# EAGLE board EEZ CF-DIC r5B5 (EAGLE 7.2.0)
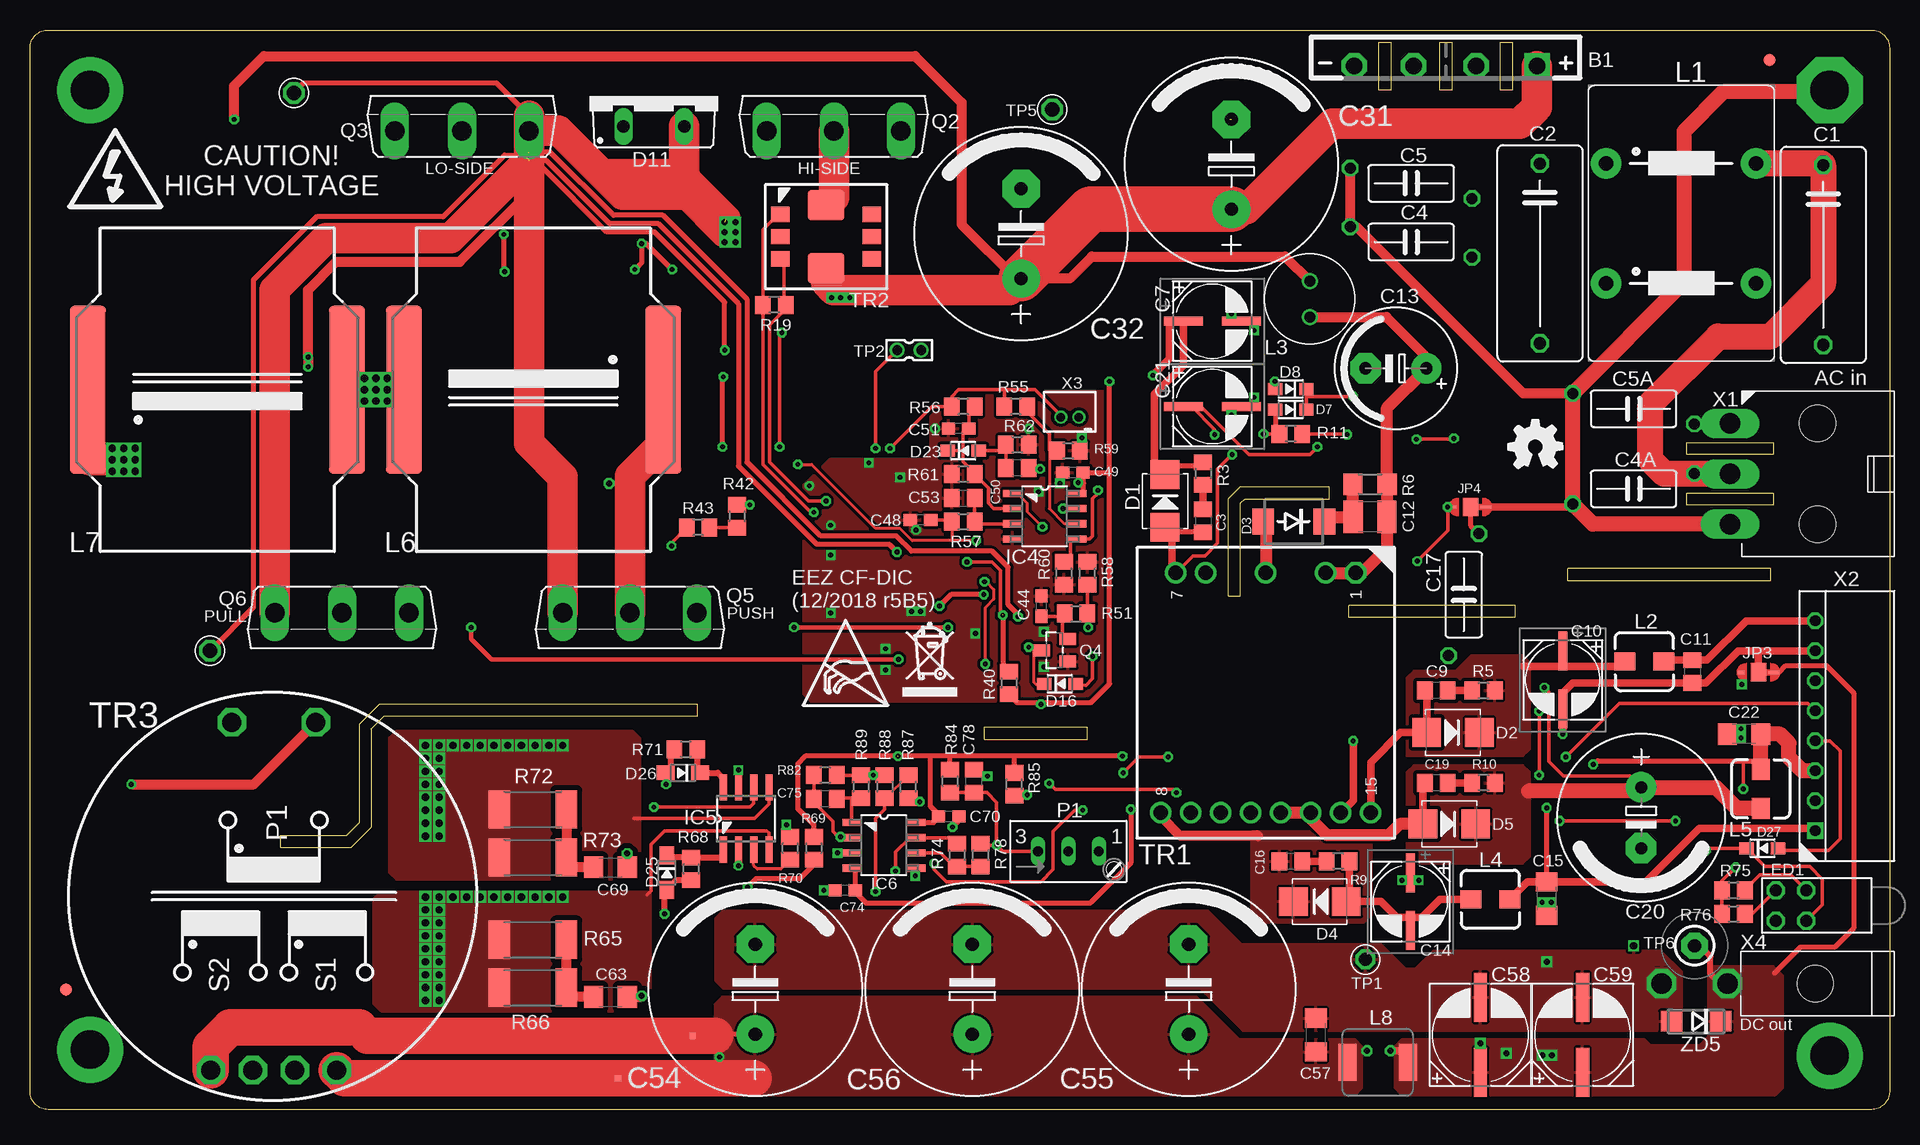
[diagram p3: board, top side]
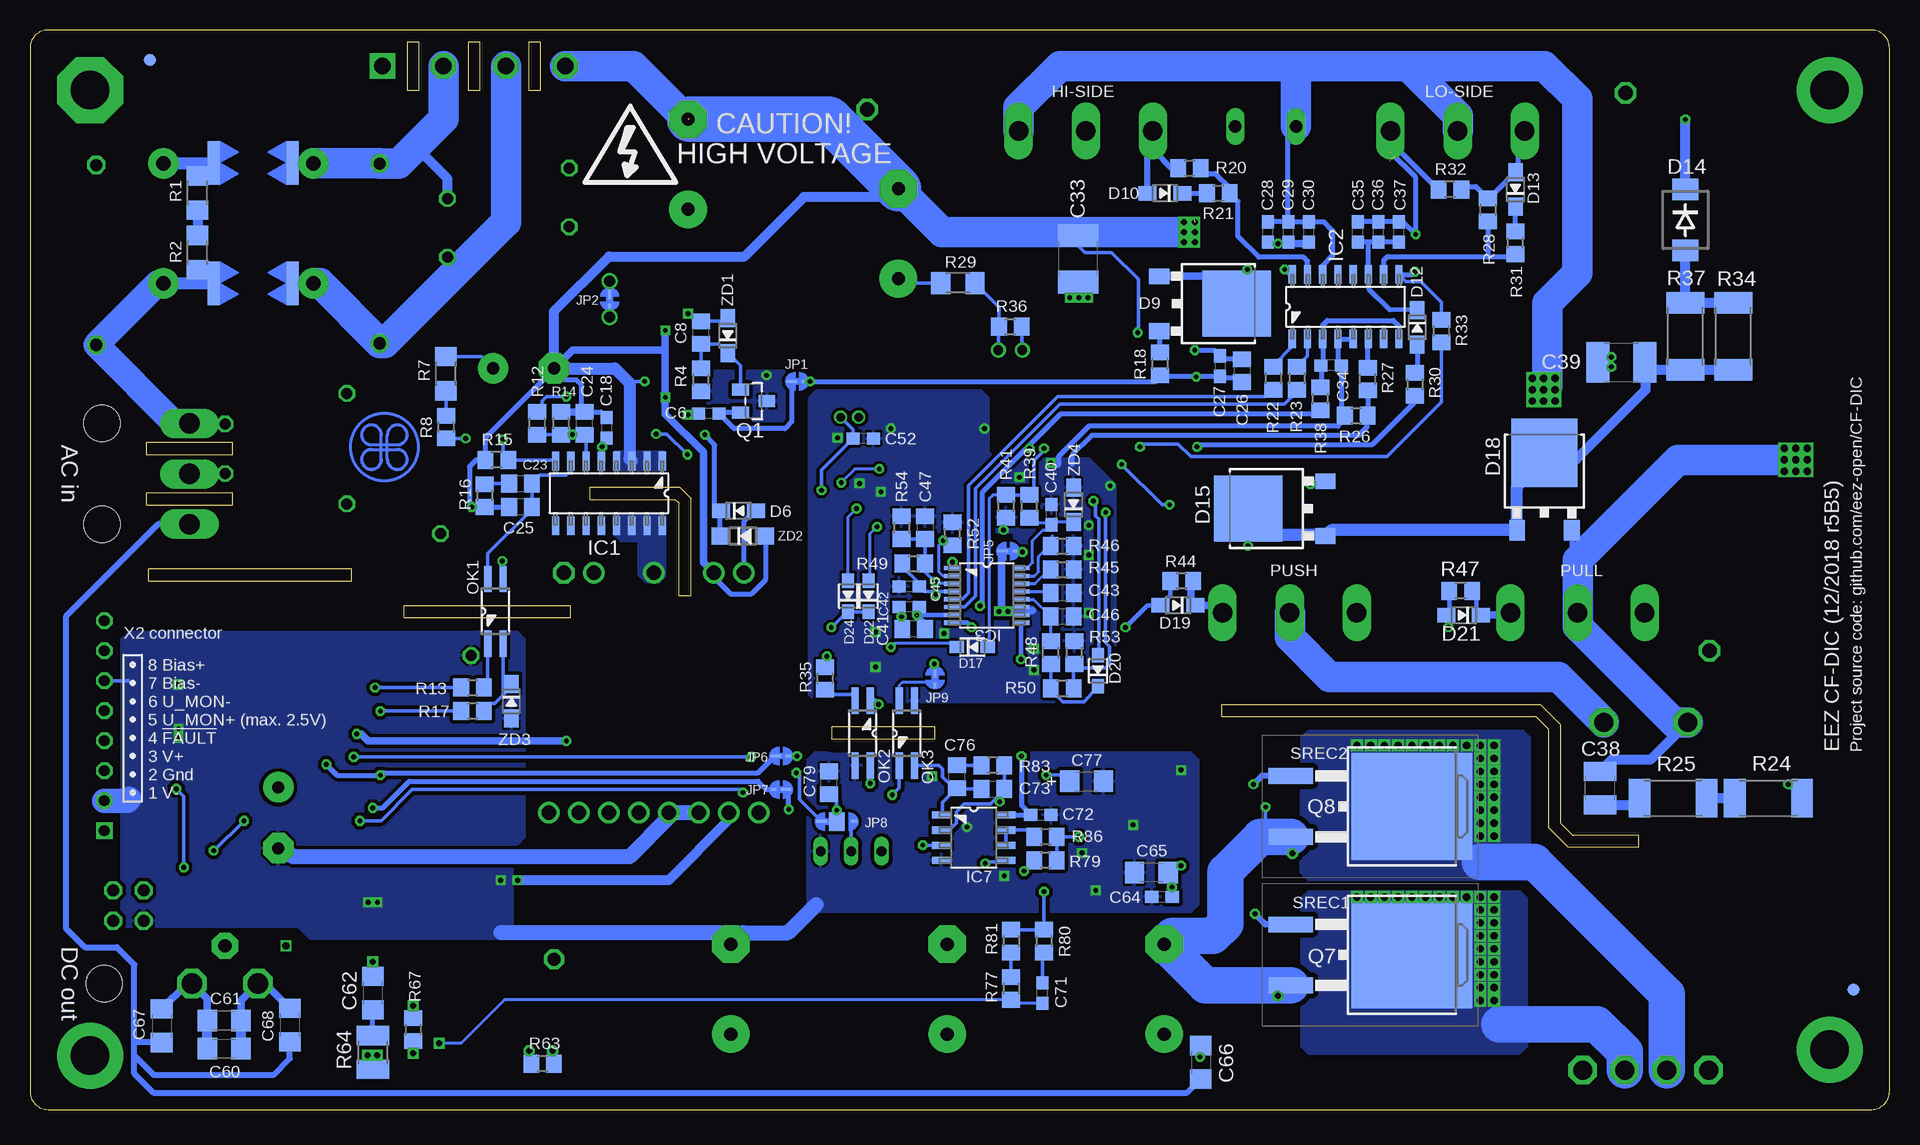
[diagram p4: board, bottom side, seen from below]

Size 155 x 90 mm. Coordinates in mm from the lower left corner, seen from the top.
Outline: 108.3,51.88 100.84,51.88 99.89,50.93 99.89,42.83 100.9,42.83 100.9,50.55 101.22,50.86 108.3,50.86 108.3,51.88
Outline: 145.1,45.09 128.21,45.09 128.21,44.07 145.1,44.07 145.1,45.09
Outline: 123.83,42.04 109.92,42.04 109.92,41.02 123.83,41.02 123.83,42.04
Outline: 79.57,31.88 88.14,31.88 88.14,30.86 79.57,30.86 79.57,31.88
Outline: 155,88.5 155,1.5 arc-90 153.5,0 1.5,0 arc-90 0,1.5 0,88.5 arc-90 1.5,90 153.5,90 arc-90 155,88.5
Outline: 55.63,32.77 55.63,33.78 29.11,33.78 27.43,32.11 27.43,23.9 26.39,22.86 20.89,22.86 20.89,21.84 26.77,21.84 28.45,23.52 28.45,31.73 29.49,32.77 55.63,32.77
Copper layers (1*16): Top 0.035mm / dielectric 1.5mm / Bottom 0.035mm
Design rules "default *": minimum track width 6mil, minimum drill 0.3mm, track to track 6mil, track to pad 6mil, pad to pad 6mil, via to via 6mil, smd to smd 6mil, copper to edge 40mil, drill to drill 8mil, minimum pad ring 4mil, minimum via ring 8mil, stop-mask expansion 2.5mil, vias tented up to drill 2.1mm, thermal gap 8mil
Net classes: 0 default: width 0.203 mm, drill 0.4 mm, clearance 0.203 mm; 2 gnd: width 0.254 mm, drill 0.4 mm, clearance 0.152 mm to class 0, clearance 0.152 mm to class 1, clearance 0.152 mm

## Footprints (pad centres in the part's own frame; a part is rotated, then mirrored left to right if it is on the bottom)
GBU4K_CRE = drill 1.4 square: + -7.62,0 | drill 1.4 octagon: - 7.62,0; AC1 -2.54,0; AC2 2.667,0
C150-072X183 = drill 1.016 octagon: 1 -7.493,0; 2 7.493,0
C0805 = smd 1.3 x 1.5: 1 -0.95,0; 2 0.95,0
CY075-032X103 = drill 0.914 octagon: 1 -5.08,1.27; 2 5.08,-1.27
CY075-032X103-ROTATED = drill 0.914 octagon: 1 -5.08,-1.27; 2 5.08,1.27
C0603 = smd 1.1 x 1: 1 -0.85,0; 2 0.85,0
CAPAE660X610N = smd 3.251 x 0.762: 1 -2.413,0; 2 2.413,0
C1210 = smd 1.6 x 2.7: 1 -1.4,0; 2 1.4,0
ECAP5/10.5 = drill 1.016 pad 2.54: + -2.54,0 | drill 1.016 pad 2.54 octagon: - 2.54,0
C1206 = smd 1.6 x 1.8: 1 -1.4,0; 2 1.4,0
ECAP5/13 = drill 1.016 pad 2.54: + -2.54,0 | drill 1.016 pad 2.54 octagon: - 2.54,0
ECAP7.5/18 = drill 1.1 pad 3.14: + -3.75,0 | drill 1.1 pad 3.14 octagon: - 3.75,0
C1812 = smd 1.9 x 3.4: 1 -1.95,0; 2 1.95,0
CAPAE830X1050N = smd 4.064 x 1.092: + -3.124,0; - 3.124,0
EC1206 = smd 1.6 x 1.8: + -1.4,0; - 1.4,0
SMB = smd 2.4 x 2.4: A 2.2,0; C -2.2,0
DO214AA = smd 1.8 x 2.2: A 2.55,0; C -2.55,0
SOD323-W = smd 1.5 x 1.2: A 1.45,0; C -1.45,0
SOD323-R = smd 1.2 x 1: A 1.3,0; C -1.3,0
TO252 = smd 1.3 x 1.7: 1 -2.285,-5.49; 2 2.285,-5.49 | smd 5.5 x 5.7: 3 0,0.95
TO220-2 = drill 1.016 long: 1 -2.54,-2.54; 2 2.54,-2.54
FIDUCIAL_DUAL = smd 1.016 x 1.016 bottom: B 0,0 | smd 1.016 x 1.016: T 0,0
SOIC-16 = smd 1.549 x 0.61: 1 -2.692,4.445; 2 -2.692,3.175; 3 -2.692,1.905; 4 -2.692,0.635; 5 -2.692,-0.635; 6 -2.692,-1.905; 7 -2.692,-3.175; 8 -2.692,-4.445; 9 2.692,-4.445; 10 2.692,-3.175; 11 2.692,-1.905; 12 2.692,-0.635; 13 2.692,0.635; 14 2.692,1.905; 15 2.692,3.175; 16 2.692,4.445
MTC16 = smd 1.422 x 0.356: 1 -2.845,2.275; 2 -2.845,1.625; 3 -2.845,0.975; 4 -2.845,0.325; 5 -2.845,-0.325; 6 -2.845,-0.975; 7 -2.845,-1.625; 8 -2.845,-2.275; 9 2.845,-2.275; 10 2.845,-1.625; 11 2.845,-0.975; 12 2.845,-0.325; 13 2.845,0.325; 14 2.845,0.975; 15 2.845,1.625; 16 2.845,2.275
SOIC127P600X173-8N = smd 1.55 x 0.6: 1 -2.7,1.9; 2 -2.7,0.63; 3 -2.7,-0.64; 4 -2.7,-1.91; 5 2.7,-1.91; 6 2.7,-0.64; 7 2.7,0.63; 8 2.7,1.9
SO8 = smd 0.6 x 2.2: 1 -1.905,-2.6; 2 -0.635,-2.6; 3 0.635,-2.6; 4 1.905,-2.6; 5 1.905,2.6; 6 0.635,2.6; 7 -0.635,2.6; 8 -1.905,2.6
JP2-NOCUT = smd 0.889 x 0.254: 1 -0.445,0 | smd 0.508 x 0.254: 2 0.635,0
JP3-CUT = smd 1.27 x 1.524: COM 0,0 | smd 0.889 x 0.254: NC -1.27,0 | smd 0.508 x 0.254: NO 1.46,0
RN214 = drill 1.2 pad 2.54: 1 -6.25,-5; 2 6.25,-5; 3 -6.25,5; 4 6.25,5
DE0403 = smd 1.5 x 1.75: 1 0,1.626; 2 0,-1.625
FERSYTER_DSZ6 = drill 0.9: P$1 -1.5,0; P$2 1.5,0
MURATA_6000B = smd 3 x 14: 1 -10.8,0; 2 10.8,0
IHLP-2020BZ-11 = smd 3.048 x 1.524: 1 0,2.515; 2 0,-2.515
L-934EB = drill 1 octagon: BA -1.27,-1.27; BC -1.27,1.27; TA 1.27,-1.27; TC 1.27,1.27
SO4 = smd 0.6 x 2.2: 1 -0.635,-2.7; 2 0.635,-2.7; 3 0.635,2.7; 4 -0.635,2.7
S64W = drill 0.813 long: A 2.54,1.27; E -2.54,1.27; S 0,1.27
SOT23-BEC = smd 1 x 1.4: B -0.95,-1.1; C 0,1.1; E 0.95,-1.1
TO247BV = drill 1.6 long: D 0,-2.921; G -5.588,-2.921; S 5.588,-2.921
SOT23 = smd 1 x 1.4: 1 -0.95,-1.1; 2 0.95,-1.1; 3 0,1.1
TO263 = smd 1.3 x 3.7: 1 -2.54,-7.87; 2 2.54,-7.87 | smd 8.9 x 10.1: 3 0,2.23
R1206 = smd 1.6 x 1.803: 1 -1.422,0; 2 1.422,0
R0805 = smd 1.3 x 1.5: 1 -0.95,0; 2 0.95,0
R2512 = smd 1.8 x 3.2: 1 -2.8,0; 2 2.8,0
R1210 = smd 1.6 x 2.7: 1 -1.4,0; 2 1.4,0
PCB-SAR_2.4MM = smd 3.632 x 1.016: 1 0,-3.302; 2 0,3.302
SHORT_NOHOLE = smd 0.5 x 0.25 bottom: P$1 0,0.117; P$2 0,-0.117
PCB_SHIELD_TAB = drill 1.1 octagon: 1 0,0
2MM-2 = drill 0.8 pad 1.27: 1 0,-1; 2 0,1
TEST-PIN_1.2MM = drill 1.2 octagon: 1 0,0
TP_1.1MM_2 = drill 0.6 square: GND 5.08,0 | drill 1.1 pad 2.184 octagon: TIP 0,0
FERYSTER_5572 = drill 1.2 octagon: 1 -10,7.5 | drill 1.2: 2 -10,5; 4 -10,0; 6 -10,-5; 7 -10,-7.5; 8 10,-8.75; 9 10,-6.25; 10 10,-3.75; 11 10,-1.25; 12 10,1.25; 13 10,3.75; 14 10,6.25; 15 10,8.75
MURATA_5300 = smd 1.27 x 1.524: 1 -1.854,-3.81; 2 0,-3.81; 3 1.854,-3.81; 4 1.854,3.81; 5 0,3.81; 6 -1.854,3.81 | smd 2.54 x 3.048: 7 2.616,0; 8 -2.616,0
VAC_DUAL_SEC = drill 1.6 octagon: P1 -14.5,3.5; P1_DOT -14.5,-3.5; S1 14.5,5.25; S1_DOT 14.5,1.75; S2 14.5,-1.75; S2_DOT 14.5,-5.25
MINIFIT_6659-3_CRE = drill 1.7 long: 1 0,-4.2; 2 0,0; 3 0,4.2 | hole 3: -7.3,4.2; -7.3,-4.2
SPOX_22-05-7085 = drill 0.9 square: 1 -8.75,0 | drill 0.9 octagon: 2 -6.25,0; 3 -3.75,0; 4 -1.25,0; 5 1.25,0; 6 3.75,0; 7 6.25,0; 8 8.75,0
B2B-ZR = drill 0.7 pad 1.1: 1 -0.75,0; 2 0.75,0
MINIFIT_39301020 = drill 1.7 octagon: 1 0,0; 2 0,5.5 | hole 3: 0,-7.3
SOD123 = smd 1.4 x 1.4: A 1.9,0; C -1.9,0
DO214AC = smd 1.8 x 1.7: A 2.05,0; C -2.05,0

## Placement (x,y rotation side)
B1  GBU4K  [GBU4K_CRE]  118,87 180 top
C1  MKP-X2-220NR15/310  [C150-072X183]  149.48,71.25 270 top
C2  MKP-X2-220NR15/310  [C150-072X183]  125.86,71.37 270 top
C3  3n3  [C0805]  97.79,49.09 270 top
C4  CY1Y-4N7  [CY075-032X103]  115.13,72.33 0 top
C4A  N.C.  [CY075-032X103-ROTATED]  133.67,51.75 0 top
C5  CY1Y-4N7  [CY075-032X103]  115.13,77.22 0 top
C5A  N.C.  [CY075-032X103]  133.67,58.42 0 top
C6  N.C.  [C0603]  98.42,58.04 180 bottom
C7  EEEFK1V470P  [CAPAE660X610N]  98.55,65.72 0 top
C8  1u  [C0805]  99.06,64.77 90 bottom
C9  3n3  [C0805]  117.22,34.92 180 top
C10  EEEFK1V470P  [CAPAE660X610N]  127.76,35.81 270 top
C11  1u  [C0805]  138.56,36.51 270 top
C12  1n/1kV  [C1210]  111.7,49.4 180 top
C13  UCY2G6R8MPD  [ECAP5/10.5]  113.86,61.79 180 top
C14  EEEFK1V470P  [CAPAE660X610N]  115.06,17.34 270 top
C15  4u7  [C1206]  126.43,17.59 90 top
C16  3n3  [C0805]  105.09,20.7 180 top
C17  CY1Y-4N7  [CY075-032X103]  119.51,42.93 270 top
C18  100n  [C0603]  106.93,56.83 270 bottom
C19  3n3  [C0805]  117.22,27.24 180 top
C20  1500u  [ECAP5/13]  134.3,24.32 270 top
C21  EEEFK1V470P  [CAPAE660X610N]  98.55,58.61 0 top
C22  4u7  [C1206]  142.88,31.31 180 top
C23  33n  [C0805]  114.11,52.2 0 bottom
C24  100p  [C0805]  108.78,57.21 90 bottom
C25  2n2  [C0805]  114.11,50.23 180 bottom
C26  1u  [C0805]  53.98,61.59 270 bottom
C27  100n  [C0603]  55.82,61.98 270 bottom
C28  10n  [C0603]  51.82,73.15 90 bottom
C29  100n  [C0603]  50.1,73.15 90 bottom
C30  100n  [C0603]  48.39,73.15 90 bottom
C31  UPH2G151MHD6  [ECAP7.5/18]  100.14,78.8 90 top
C32  UPH2G151MHD6  [ECAP7.5/18]  82.61,73.03 90 top
C33  100n/500V  [C1812]  67.63,70.93 90 bottom
C34  100n  [C0603]  46.55,62.04 180 bottom
C35  10n  [C0603]  44.32,73.15 90 bottom
C36  100n  [C0603]  42.61,73.15 90 bottom
C37  100n  [C0603]  40.89,73.15 90 bottom
C38  4n7/200V  [C1210]  24.13,26.8 90 bottom
C39  100n/500V  [C1812]  22.35,62.29 0 bottom
C40  100n  [C0603]  69.85,49.59 90 bottom
C41  1u  [C0805]  81.34,40.07 180 bottom
C42  100n  [C0603]  81.72,41.91 180 bottom
C43  1u  [C0805]  68.96,43.05 180 bottom
C44  10n  [C0603]  84.33,41.97 90 top
C45  100n  [C0603]  81.72,43.62 0 bottom
C46  2n2  [C0805]  68.96,41.08 180 bottom
C47  470p  [C0805]  80.39,48.51 270 bottom
C48  10n  [C0603]  74.23,49.15 180 top
C49  100n  [C0603]  86.93,53.09 180 top
C50  1u  [C0805]  82.3,53.47 180 top
C51  100n  [C0603]  77.41,56.77 180 top
C52  N.C.  [C0603]  85.53,55.94 180 bottom
C53  1u  [C0805]  77.79,50.99 0 top
C54  UPW1J152MHD  [ECAP7.5/18]  60.45,10.03 90 top
C55  UPW1J152MHD  [ECAP7.5/18]  96.58,10.03 90 top
C56  UPW1J152MHD  [ECAP7.5/18]  78.55,10.03 90 top
C57  1u/100V  [C1206]  107.19,6.22 90 top
C58  HHXC630ARA330MHA0G  [CAPAE830X1050N]  120.9,6.22 90 top
C59  N.C.  [CAPAE830X1050N]  129.41,6.22 90 top
C60  1u/100V  [C1206]  138.81,5.08 0 bottom
C61  100n/100V  [C1206]  138.81,7.43 0 bottom
C62  N.C.  [C1206]  126.43,9.72 270 bottom
C63  4n7/200V  [C1206]  48.39,9.4 0 top
C64  100n  [C0603]  60.64,17.72 180 bottom
C65  4u7  [C1206]  61.53,19.75 180 bottom
C66  4n7/200V  [C1206]  57.4,3.94 270 bottom
C67  4n7/200V  [C1206]  144.02,6.99 270 bottom
C68  4n7/200V  [C1206]  133.35,7.05 270 bottom
C69  4n7/200V  [C1206]  48.39,20.19 0 top
C70  100n  [C0603]  76.58,24.45 0 top
C71  10n  [C0603]  70.61,9.72 90 bottom
C72  100n  [C0603]  70.74,24.57 0 bottom
C73  100p  [C0805]  74.74,26.73 0 bottom
C74  100n  [C0603]  67.94,18.29 180 top
C75  100p  [C0805]  66.29,25.91 180 top
C76  2n2  [C0805]  77.72,27.75 90 bottom
C77  4u7  [EC1206]  66.93,27.37 0 bottom
C78  1u  [C0805]  78.68,27.37 90 top
C79  N.C.  [C0805]  88.39,27.24 90 bottom
D1  SS110B  [SMB]  94.61,50.74 270 top
D2  SS110B  [SMB]  118.62,31.43 180 top
D3  US1K-DIO  [DO214AA]  105.35,49.02 180 top
D4  SS110B  [SMB]  107.51,17.34 0 top
D5  SS110B  [SMB]  118.3,23.81 180 top
D6  1N5819HW-7-F  [SOD323-W]  95.95,49.91 0 bottom
D7  BAS316  [SOD323-R]  105.09,58.36 180 top
D8  BAS316  [SOD323-R]  105.09,60.07 180 top
D9  C3D02065E  [TO252]  55.37,67.18 270 bottom
D10  1N5819HW-7-F  [SOD323-W]  60.39,76.39 180 bottom
D11  C3D06065A  [TO220-2]  52,84.5 0 top
D12  1N5819HW-7-F  [SOD323-W]  39.37,65.21 270 bottom
D13  1N5819HW-7-F  [SOD323-W]  31.18,76.71 90 bottom
D14  US1K-DIO  [DO214AA]  17.02,74.17 270 bottom
D15  C3D02065E  [TO252]  52.51,50.1 90 bottom
D16  BAS316  [SOD323-R]  85.85,35.5 0 top
D17  BAS316  [SOD323-R]  76.45,38.54 0 bottom
D18  C3D02065E  [TO252]  28.77,53.78 0 bottom
D19  N.C.  [SOD323-W]  59.31,42.04 180 bottom
D20  BAS316  [SOD323-R]  65.98,36.58 90 bottom
D21  N.C.  [SOD323-W]  35.5,41.21 180 bottom
D22  BAS316  [SOD323-R]  85.09,42.8 90 bottom
D23  BAS316  [SOD323-R]  77.79,54.93 0 top
D24  BAS316  [SOD323-R]  86.8,42.8 90 bottom
D25  1N5819HW-7-F  [SOD323-W]  53.09,19.75 270 top
D26  1N5819HW-7-F  [SOD323-W]  54.42,28.07 180 top
D27  BAS316  [SOD323-R]  144.4,21.78 0 top
EEZ_SIGNATURE  SIGNATURESMALL  [SIGNATURE_5MM]  125.46,55.22 180 top
FM1  FIDUCIAL_2  [FIDUCIAL_DUAL]  145,87.5 270 top
FM2  FIDUCIAL_2  [FIDUCIAL_DUAL]  3,10 270 top
IC1  VIPer35L  [SOIC-16]  106.74,51.37 270 bottom
IC2  SI8233BB-D-IS1  [SOIC-16]  45.34,66.93 90 bottom
IC3  LM5041B  [MTC16]  75.25,42.86 0 bottom
IC4  LM258D  [SOIC127P600X173-8N]  84.58,49.47 0 top
IC5  IR11688STRPBF  [SO8]  59.69,24.26 0 top
IC6  LM258D  [SOIC127P600X173-8N]  71.18,22.03 0 top
IC7  TL103W  [SOIC127P600X173-8N]  76.33,22.67 0 bottom
JP1  JP2-NOCUT  [JP2-NOCUT]  91.06,60.71 0 bottom
JP2  JP2-NOCUT  [JP2-NOCUT]  106.68,67.56 270 bottom
JP3  JP3-CUT  [JP3-CUT]  144.08,36.45 180 top
JP4  JP3-CUT  [JP3-CUT]  120.08,50.23 180 top
JP5  JP2-NOCUT  [JP2-NOCUT]  73.47,46.55 0 bottom
JP6  JP2-NOCUT  [JP2-NOCUT]  92.39,29.46 0 bottom
JP7  JP2-NOCUT  [JP2-NOCUT]  92.39,26.67 180 bottom
JP8  JP3-CUT  [JP3-CUT]  87.76,24 0 bottom
JP9  JP2-NOCUT  [JP2-NOCUT]  79.57,36 270 bottom
L1  RN214-2.5-02-3M3  [RN214]  137.64,73.88 0 top
L2  DLG-0403-180  [DE0403]  134.56,37.34 90 top
L3  RLB0812-471KL  [FERSYTER_DSZ6]  106.68,67.56 270 top
L4  DLG-0403-180  [DE0403]  121.73,17.53 90 top
L5  DLG-0403-180  [DE0403]  144.27,26.73 180 top
L6  60B684C  [MURATA_6000B]  41.97,60.01 180 top
L7  60B684C  [MURATA_6000B]  15.62,60.01 0 top
L8  IHLP2020CZER3R3M11  [IHLP-2020BZ-11]  112.33,3.94 90 top
LED1  L-934EB/1Y1ID-RV  [L-934EB]  146.8,17 180 top
OK1  TLP291-GB.SE-T  [SO4]  116.2,41.53 0 bottom
OK2  TLP291-GB.SE-T  [SO4]  85.6,31.37 180 bottom
OK3  TLP291-GB.SE-T  [SO4]  81.92,31.37 0 bottom
P1  T910W-50K  [S64W]  86.55,20.26 0 top
Q1  MMBT5551  [SOT23-BEC]  94.68,59.05 270 bottom
Q2  C3M0280090D  [TO247BV]  67,84.5 0 top
Q3  C3M0280090D  [TO247BV]  36,84.5 0 top
Q4  NYC0102BLT1G  [SOT23]  85.41,38.29 90 top
Q5  C3M0280090D  [TO247BV]  50,38.5 180 top
Q6  C3M0280090D  [TO247BV]  26,38.5 180 top
Q7  FDD86250-F085  [TO263]  42.04,12.89 270 bottom
Q8  FDD86250-F085  [TO263]  42.04,25.27 270 bottom
R1  220K  [R1206]  141.04,76.4 270 bottom
R2  220K  [R1206]  141.04,71.45 270 bottom
R3  120R  [R0805]  97.79,53.02 270 top
R4  1K8  [R0805]  99.06,60.83 90 bottom
R5  120R  [R0805]  121.16,34.92 180 top
R6  220K  [R1206]  111.7,52.13 180 top
R7  220K  [R1206]  120.33,61.34 270 bottom
R8  100K  [R0805]  120.33,56.9 270 bottom
R9  120R  [R0805]  109.03,20.7 180 top
R10  120R  [R0805]  121.16,27.24 180 top
R11  N.C.  [R0805]  105.09,56.32 180 top
R12  47K  [R0805]  112.71,57.21 90 bottom
R13  750R  [R0805]  118.11,35.18 0 bottom
R14  12K  [R0805]  110.74,57.21 270 bottom
R15  1K8  [R0805]  116.08,54.17 180 bottom
R16  47K  [R0805]  117.09,51.18 270 bottom
R17  1K  [R0805]  118.11,33.21 180 bottom
R18  10R  [R0805]  60.83,62.17 270 bottom
R19  10K  [R0805]  62.04,67.08 180 top
R20  33R  [R0805]  58.36,78.49 0 bottom
R21  10R  [R0805]  55.94,76.39 0 bottom
R22  100R  [R0805]  51.37,60.96 270 bottom
R23  100R  [R0805]  49.4,60.96 270 bottom
R24  22R/2-3W  [R2512]  10.1,25.97 0 bottom
R25  22R/2-3W  [R2512]  18.03,25.97 0 bottom
R26  1R  [R0805]  44.45,57.85 0 bottom
R27  30K  [R0805]  43.5,60.9 90 bottom
R28  33R  [R0805]  33.46,74.99 90 bottom
R29  220K  [R1206]  77.66,68.9 0 bottom
R30  10R  [R0805]  39.56,60.45 270 bottom
R31  10R  [R0805]  31.18,72.26 90 bottom
R32  47K  [R0805]  36.64,76.71 180 bottom
R33  1R  [R0805]  37.34,64.9 90 bottom
R34  22R/2-3W  [R2512]  13.02,64.45 90 bottom
R35  1K  [R0805]  88.71,35.94 90 bottom
R36  100K  [R0805]  73.28,65.28 0 bottom
R37  22R/2-3W  [R2512]  17.02,64.45 90 bottom
R38  10R  [R0805]  47.43,59.25 90 bottom
R39  1K  [R0805]  71.69,50.29 90 bottom
R40  10R  [R0805]  81.6,35.56 270 top
R41  10K  [R0805]  73.66,50.29 270 bottom
R42  30K  [R0805]  58.93,49.47 270 top
R43  100K  [R0805]  55.69,48.51 180 top
R44  33R  [R0805]  58.99,44.07 180 bottom
R45  30K  [R0805]  68.96,45.02 0 bottom
R46  82K  [R0805]  68.96,46.99 0 bottom
R47  33R  [R0805]  35.75,43.24 180 bottom
R48  1K  [R0805]  69.91,38.1 90 bottom
R49  N.C.  [R0805]  81.34,45.53 0 bottom
R50  6R2  [R0805]  68.96,35.12 0 bottom
R51  4K7  [R0805]  87.19,41.34 0 top
R52  750R  [R0805]  78.11,48.01 90 bottom
R53  1K  [R0805]  67.94,38.1 90 bottom
R54  8K2  [R0805]  82.36,48.51 270 bottom
R55  4K7  [R0805]  82.17,58.61 180 top
R56  5K6  [R0805]  77.79,58.61 180 top
R57  47K  [R0805]  77.79,49.02 0 top
R58  1K  [R0805]  88.14,44.7 90 top
R59  30K  [R0805]  86.55,54.93 0 top
R60  10K  [R0805]  86.17,44.7 270 top
R61  1K  [R0805]  77.79,52.96 180 top
R62  1K  [R0805]  82.3,55.44 0 top
R63  120R  [R0805]  112.27,3.81 180 bottom
R64  N.C.  [R1210]  126.43,4.76 270 bottom
R65  22R/2-3W  [R2512]  41.91,14.16 0 top
R66  22R/2-3W  [R2512]  41.91,10.16 0 top
R67  47K  [R0805]  123.06,6.67 270 bottom
R68  3R3  [R0805]  55.12,20.07 90 top
R69  10R  [R0805]  65.34,21.78 270 top
R70  47K  [R0805]  63.37,21.78 90 top
R71  3R3  [R0805]  54.67,30.04 0 top
R72  22R/2-3W  [R2512]  41.91,25.02 0 top
R73  22R/2-3W  [R2512]  41.91,21.02 0 top
R74  10K  [R0805]  77.28,21.21 270 top
R75  470R  [R0805]  141.99,18.29 0 top
R76  470R  [R0805]  141.99,16.32 0 top
R77  100K  [R0805]  73.22,10.1 270 bottom
R78  10K  [R0805]  79.25,21.21 90 top
R79  750R  [R0805]  70.36,20.76 180 bottom
R80  470R  [R0805]  70.48,14.03 270 bottom
R81  51K  [R0805]  73.22,14.03 270 bottom
R82  750R  [R0805]  66.29,27.88 180 top
R83  30K  [R0805]  74.74,28.7 180 bottom
R84  1K8  [R0805]  76.71,27.37 90 top
R85  3K3  [R0805]  82.04,27.11 90 top
R86  750R  [R0805]  70.36,22.73 180 bottom
R87  10K  [R0805]  73.22,26.92 90 top
R88  7K5  [R0805]  71.25,26.92 270 top
R89  220R  [R0805]  69.28,26.92 270 top
SAR1  PCB 2.4mm  [PCB-SAR_2.4MM]  136.4,78.92 270 bottom
SAR2  PCB 2.4mm  [PCB-SAR_2.4MM]  136.4,68.88 270 bottom
SH1  [SHORT_NOHOLE]  100.14,82.55 270 top
SH2  [SHORT_NOHOLE]  49.02,2.6 270 bottom
SH3  [SHORT_NOHOLE]  55.24,6.16 90 bottom
TP1  [PCB_SHIELD_TAB]  111.32,12.51 0 top
TP2  [2MM-2]  73.28,63.31 90 top
TP3  [TEST-PIN_1.2MM]  22,84.75 270 top
TP4  [TEST-PIN_1.2MM]  15,38.25 270 top
TP5  [TEST-PIN_1.2MM]  85.22,83.38 0 top
TP6  [TP_1.1MM_2]  138.75,13.65 180 top
TR1  Feryster 5572  [FERYSTER_5572]  103.01,34.73 270 top
TR2  53100C  [MURATA_5300]  66.36,72.77 270 top
TR3  VAC T60006-L2025-W380  [VAC_DUAL_SEC]  20.32,17.78 270 top
U$2  [RECYCLE_BIN1/8]  72.71,34.42 0 top
U$4  [ESD_SYMBOL]  64.42,33.7 0 top
X1  39-30-3035  [MINIFIT_6659-3_CRE]  141.7,53 180 top
X2  22-05-7085  [SPOX_22-05-7085]  148.8,32 90 top
X3  B2B-ZR  [B2B-ZR]  86.68,57.72 180 top
X4  39-30-1020  [MINIFIT_39301020]  141.5,10.5 90 top
ZD1  BZX384-C13  [SOD323-W]  96.84,64.52 90 bottom
ZD2  BZT52C20-DC  [SOD123]  95.57,47.82 0 bottom
ZD3  MMSZ5V1T1G  [SOD323-W]  114.87,34.04 270 bottom
ZD4  MMSZ5V1T1G  [SOD323-W]  68.01,50.42 90 bottom
ZD5  SMAJ58A-TR  [DO214AC]  138.87,7.37 180 top

## Tracks (layer width: path | path; a pad name or v marks a point on that pad's centre or on a via)
0V  (via drill 0.4, 0.5)  (5 unrouted)
  Top 0.305: D8.A 103.79,60.67 v103.76,60.71 | 42.02,81.6 41.8,81.6 Q3.S | 41.59,79.12 41.59,79.76 41.56,79.79 42.13,79.79 42.16,79.82 | v62.48,55.24 62.48,64.58 v62.67,64.77 | v118.17,50.23 118.17,48.26 v115.63,45.72 | v102.04,64.96 102.04,65.66 101.98,65.72 C7.2 100.14,65.72 v100.14,66.36
  Top 0.406: 42.16,79.82 43.37,79.82 48.64,74.55 52.77,74.55 59.75,67.56 59.75,53.98 65.91,47.82 72.2,47.82 73.47,46.55 80.2,46.55 81.53,45.21 81.53,42.1 82.36,41.27 v82.36,41.08 | 41.59,79.06 40.75,79.06 | 41.59,79.12 43.05,79.12 48.32,73.85 52.39,73.85 59.05,67.18 59.05,53.66 65.6,47.12 71.63,47.12 v72.26,46.48 | 102.04,58.55 101.98,58.61 C21.2 100.08,58.61 100.14,58.55 v100.14,57.91 | v58.8,72.33 v58.8,73.15 v58.8,73.98 v57.91,73.98 v57.91,73.15 v57.91,72.33 | 38.8,75.44 38.26,75.85 | 42.55,77.41 41.59,77.41 | 41.59,78.55 42.67,78.55 48.07,73.15 52.07,73.15 57.91,67.31 v57.91,63.31 | JP4.NO v118.17,50.23 | TP3.1 22,84.8 22.8,85.6 38.86,85.6 41.59,82.87 | 41.21,79.44 41.08,79.57 39.56,79.57 34.42,74.42 23.88,74.42 18.61,69.15 18.61,41.85 TP4.1 | v39.5,72.96 39.5,69.91 v39.56,69.85 | 54.55,77.98 54.55,77.86 54.54,77.85
  Top 0.61: 102.04,58.55 v102.04,59.37 | 41.66,78.3 41.59,78.23
  Top 0.813: 41.37,81.62 Q3.S | 41.59,77.22 41.59,76.45 35.81,70.67 25.53,70.67 23.18,68.33 v23.18,62.74 v23.18,61.91
  Top 2.54: 42.02,81.6 44.07,81.6 49.4,76.26 54.8,76.26 | 41.59,79.06 41.59,79.18 38.26,75.85 35.05,72.64 24.7,72.64 20.41,68.36 Q6.S | 41.59,82.87 41.59,79.12 41.59,78.55 41.59,78.23 41.59,77.41 41.59,77.22 41.59,55.56 44.41,52.74 Q5.S | 54.8,76.26 v57.91,73.15 | D11.2 54.54,77.85 54.54,76.52 54.8,76.26 | 47.75,77.98 54.55,77.98 | 54.86,77.34 57.98,74.23
  Bottom 0.305: v103.76,60.71 104.9,60.71 105.03,60.58 | 114.68,49.85 C25.2 | R16.2 | 37.21,63.95 R33.1 37.34,58.99 41.91,54.42 58.23,54.42 59.31,55.5 62.23,55.5 v62.48,55.24 | R33.2 37.34,67.31 39.05,69.03 40.3,69.03 IC2.9 | 67.56,73.15 67.63,73.09 C33.2 67.63,72.01 67.06,71.44 64.83,71.44 62.61,69.22 62.61,64.83 v62.67,64.77 | OK1.3 115.57,45.66 v115.63,45.72 | 118.36,50.23 v118.17,50.23 | ZD1.A 97.08,65.72 C8.2 99.5,65.72 v100.14,66.36
  Bottom 0.406: R14.1 110.56,58.16 109.03,58.17 109.03,60.39 109.47,60.83 110.36,60.83 C13.- 111.32,61.72 117.03,56.01 R15.2 117.79,54.17 118.36,53.59 118.36,50.23 | R16.2 C25.2 | R16.2 | C24.2 107.42,58.16 C18.1 | ZD2.A 93.66,44.2 94.87,42.99 96.58,42.99 98.01,44.42 TR1.6 | C35.2 C36.2 C37.2 41.11,74.04 40.58,74.04 v39.5,72.96 39.5,77.72 41.59,79.81 41.59,80.71 | IC2.9 39.79,69.62 v39.56,69.85 | C26.1 55.53,62.55 C27.1 56.3,63.31 v57.91,63.31 | R32.2 41.59,80.71 | 41.59,80.71 Q3.S | 58.93,73.15 v58.8,73.15 | R16.2 v118.17,50.23 | C6.2 100.01,58.04 v100.14,57.91 | TP5.1 85.34,83.38 87.28,81.44 | C41.2 82.29,41.02 v82.36,41.08 82.36,41.7 C42.2
  Bottom 0.508: v72.26,46.48 72.83,46.48 JP5.2
  Bottom 0.61: 102.04,63.31 v102.04,59.37 102.04,57.98 98.87,54.8 98.87,45.59 TR1.6 | 102.04,63.31 v102.04,64.96 | R14.1 C24.2 | 102.04,63.31 109.79,63.31 C13.-
  Bottom 0.813: C32.- 83.32,76.07 90.49,76.07 95.44,71.12 106.74,71.12 111.32,66.55 C13.- | C39.1 24.3,62.82 v23.18,62.74
  Bottom 1.016: C13.- 106.24,61.78 105.03,60.58 105.03,54.25 IC1.3
  Bottom 2.54: 58.93,73.15 67.56,73.15 78.99,73.15 C32.-
  Bottom 3.81: SH1.P$2 88.39,82.55 87.28,81.44 C32.-
  pour Bottom (no thermals): 102.11,54.8 106.3,54.8 106.3,53.34 102.11,53.34
6VAC
  Top 0.61: 105.47,24.67 105.41,24.73 | D5.A 116.1,27.13 C19.2
  Top 1.016: TR1.12 105.41,24.73 TR1.13 106.76,24.24 108.14,22.86 113.22,22.86 114.17,23.81 D5.A
7VAC
  Top 0.813: TR1.8 94.26,24.42 95.82,22.86 102.3,22.86 102.36,22.8
  pour Top: 111.76,23.18 111.76,16.19 111.19,15.62 102.43,15.62 101.85,16.19 101.85,23.18
15VAC
  Top 0.61: C9.2 116.42,34.78 D2.A 114.24,31.43 111.76,28.96 TR1.15
!FAULT  (via drill 0.4)
  Top 0.305: v137.16,24.07 v127.51,24.07 | v84.96,27.18 85.47,26.67 95.31,26.67 v95.57,26.42 | v139.7,21.59 139.89,21.78 D27.C 144.62,20.26 148.34,20.26 149.42,19.18 149.42,17.08 149.35,17.02 149.35,17.01 LED1.BC
  Bottom 0.305: v127.51,24.07 125.73,24.07 123.13,26.67 95.82,26.67 v95.57,26.42 | v139.7,21.59 139.64,21.59 v137.16,24.07 | v84.96,27.18 OK2.4
+2.5VREF  (via drill 0.4)
  Top 0.305: R84.1 77.92,26.42 | 77.92,26.42 C78.1 79.75,26.42 80.58,25.59 v80.58,22.04 | 77.98,26.36 77.92,26.42 | R78.2 79.5,22.04 v80.58,22.04 | v80.58,22.04 81.09,21.53 P1.E
  Bottom 0.305: IC7.3 v80.58,22.04
+5VREF  (via drill 0.4)
  Top 0.305: v71.69,55.12 75.18,58.61 R56.2 76.83,59.44 77.41,60.01 81.22,60.01 | R55.2 81.22,60.01 | 81.22,60.01 83.76,60.01 85.93,57.84 X3.2
  Top 0.406: v79.5,42.93 76.77,42.93 v75.82,41.97
  Bottom 0.254: C45.2 80.96,43.62 | R49.1 82.74,45.4
  Bottom 0.305: IC3.4 79.57,43.19 | 79.57,43.19 80.44,43.19 C45.2 80.87,43.85 82.29,45.27 R49.1 | v79.5,42.93 79.57,43.19 | v71.69,55.12 71.69,55.37 71.63,55.44
  Bottom 0.406: R38.1 47.43,57.98 69.09,57.98 71.63,55.44 75.63,51.44 75.63,42.16 v75.82,41.97
+6V_REC  (via drill 0.4)
  Top 0.305: C20.+ 133.35,27.81 127.83,27.81 126.62,29.02 126.62,34.8 v126.24,35.18
  Top 1.27: 124.9,26.54 133.99,26.54 C20.+ 140.53,26.86 142.24,25.15 144.23,25.15 L5.1
  Bottom 0.305: R13.1 v126.24,35.18
  pour Top (isolate 0.305): 124.97,28.13 124.97,21.08 124.4,20.51 114.81,20.51 114.81,28.13 115.38,28.7 124.4,28.7
+12V  (via drill 0.4)
  Top 0.254: v87.38,52.26 87.76,52.26 87.82,52.2
  Top 0.305: C50.1 84.14,53.47 v84.2,53.4
  Top 0.406: v57.72,55.24 57.72,61.02 v57.78,61.09 | R40.2 82.3,33.91 84.26,33.91 | 89.98,53.15 89.98,35.5 88.39,33.91 84.26,33.91 | 89.98,53.15 v89.98,60.71 | 89.98,53.15 89.92,53.09 C49.1 87.82,52.79 87.82,52.2 87.82,51.37 IC4.8 | v84.26,33.78 84.26,33.91
  Bottom 0.254: v84.2,53.4 86.23,53.4 v87.38,52.26
  Bottom 0.406: C26.2 53.98,60.96 55.65,60.96 C27.2 55.85,61.09 v57.78,61.09 60.7,61.09 R18.2 61.15,60.71 v89.98,60.71 JP1.2 | R30.2 39.56,58.99 43.12,55.44 57.53,55.44 v57.72,55.24 | OK2.1 84.55,34.07 v84.26,33.78
+15V_REC
  Top 0.254: 132.33,37.02 132.61,37.02 L2.1
  Top 0.61: C10.1 127.76,36.96 | 127.76,36.96 124.46,36.96 | 127.76,36.96 132.27,36.96 132.33,37.02
  pour Top (isolate 0.305): 124.4,29.46 114.81,29.46 114.81,36 115.38,36.58 118.87,36.58 120.14,37.85 124.4,37.85 124.97,37.27 124.97,30.04
-7V_REC
  Top 0.61: L4.1 117.54,17.53 116.01,16 115.13,16 | 115.13,16 113.92,16 112.58,17.34 D4.A 109.98,17.61 R9.1 | C14.2 115.06,15.94 115.13,16
-15V  (via drill 0.4)
  Top 0.61: v127.76,31.3 C10.2 127.76,34.73 128.59,35.56 C11.2 139.7,35.56 142.39,38.25 144.15,38.25 | v110.3,30.73 110.3,25.77 TR1.14 | X2.7 144.15,38.25 | JP3.COM 144.08,38.19 144.15,38.25
  Bottom 0.61: v110.3,30.73 126.81,30.73 127.38,31.3 v127.76,31.3
AC_L_IN
  Bottom 0.61: X1.1 139.31,57.2 C5A.2
  Bottom 1.016: L1.2 140.91,68.88 | 140.91,68.88 SAR2.1 | R2.2 141.04,69 140.91,68.88
  Bottom 2.184: X1.1 142.93,57.2 C1.2 144.36,68.88 L1.2
AC_N_IN
  Top 0.305: C4A.2 138.75,53
  Top 2.184: X1.2 138.75,53 136.23,53 135.06,54.17 135.06,58.8 140.72,64.45 145.1,64.45 149.48,68.83 C1.1 149.34,78.88 L1.4
  Bottom 1.016: L1.4 141.1,78.88 | 141.1,78.88 139.74,78.88 SAR1.1 | R1.1 141.04,78.81 141.1,78.88
AGND  (via drill 0.4)
  Top 0.305: R59.2 v87.69,56.01
  Bottom 0.254: 43.56,57.47 43.56,57.79 R26.2
  Bottom 0.406: IC2.5 IC2.4 45.97,62.32 C34.1 45.7,58.14 R26.1 45.4,57.53 45.97,56.96 66.74,56.96 69.28,54.42 69.28,53.72 | 67.88,52 ZD4.A | 43.56,57.47 43.56,56.9 44.26,56.2 66.48,56.2 68.14,54.55 68.14,53.78 | R27.1 43.5,57.53 R26.2 | 74.04,41.59 74.17,41.59 v74.23,41.53 | v73.47,41.53 73.47,41.59
  Bottom 0.61: 73.53,41.59 73.47,41.59 71.44,41.59 | 74.04,41.59 74.04,46.42 JP5.1
  other vias: 85.85,52.2 69.91,53.91 73.85,48.32 71.31,38.42 71.31,36.64 72.52,52.7 84.07,51.5 84.52,36.89 66.74,48.7 66.74,46.23 66.74,41.4 78.8,39.69 64.96,52.01 84.52,39.81 83.25,56.77 75.44,56.77
  pour Bottom (isolate 0.254): 74.42,54.23 74.42,48.13 72.96,48.13 72.96,40.64 74.74,40.64 74.74,54.42 75.12,54.8 75.12,59.31 75.69,59.88 89.47,59.88 90.04,59.31 90.04,34.61 89.47,34.04 65.09,34.04 64.52,34.61 64.52,52.07 66.67,54.23
  pour Top (isolate 0.254): 66.67,54.23 74.55,54.23 75.12,54.8 75.12,59.31 75.69,59.88 89.47,59.88 90.04,59.31 90.04,34.04 65.09,34.04 64.52,34.61 64.52,52.07
AUX_AC  (via drill 0.4)
  Top 0.305: R11.2 v102.81,56.33 | TR1.7 96.94,46.16 97.92,46.16 99,47.24 99,53.4 v100.2,54.61
  Top 0.406: D7.A 103.79,56.67 R11.2 | 95.21,48.26 D1.A | C3.2 95.34,48.14 95.21,48.01
  Top 0.61: 95.21,48.26 95.21,48.01 95.21,45.04 TR1.7
  Bottom 0.305: v102.81,56.33 101.92,56.33 v100.2,54.61
  Bottom 0.406: D6.A 94.55,49.91 95.5,48.96 TR1.7
AUX_REC  (via drill 0.4)
  Top 0.406: C7.1 95.06,65.66 95,65.6 | R3.1 97.79,53.78 97.66,53.66 95.34,53.66 D1.C
  Top 0.61: D1.C 94.7,52.87 93.73,53.85 93.73,59.63 96.14,62.04 C7.1 | v93.6,61.21 95,62.61 95,65.6
  pour Bottom (isolate 0.305): 98.68,61.53 98.68,51.5 91.12,51.5 91.12,61.53
BUCK_OUT  (via drill 0.6)
  Top 2.184: L6.2 31.17,64.45 | L7.2 26.42,55.57
  Top 2.54: v28.83,60.01 L7.2 | v29.78,60.01 L6.2
  Bottom 0.305: v29.78,59.05 v29.78,60.01 v29.78,60.96 v28.83,60.96 | v28.83,60.01 v28.83,59.05 | v27.88,59.05 v27.88,60.01 v27.88,60.96 v28.83,60.96 | v28.83,60.96 28.51,60.96 28.51,60.45
  Bottom 0.406: 50.14,74.04 C29.2 C30.2 47.14,74 46.42,73.28 46.42,71.18 47.24,70.36 IC2.14 | 50.14,74.04 50.14,81.51 D11.1 | 50.14,74.04 51.78,74.04 C28.2
  Bottom 0.508: C28.2 51.84,74
  Bottom 2.54: 40.13,87 49.47,87 | 49.47,87 69.15,87 72.59,83.56 Q2.S | v28.83,60.01 28.51,60.33 28.51,60.45 28.51,67.25 26.04,69.72 26.04,84.26 28.77,87 40.13,87 | Q3.D 36,82.86 40.13,87 | D11.1 49.46,86.99 49.47,87
CLAMP_C  (via drill 0.4)
  Top 0.305: v53.47,46.99 53.47,47.24 R43.2
  Bottom 0.305: D15.3 53.47,46.8 v53.47,46.99
  Bottom 0.813: R34.1 R37.1 20.07,61.65 20.32,61.4 | D18.3 26.1,54.23 20.32,60.01 20.32,61.4 | 20.32,61.4 20.32,62.21 C39.2
  Bottom 1.016: D18.3 31.05,51.94 D18.1 46.55,48.29 D15.1 47.12,47.82 47.18,47.88 51.24,47.88 D15.3 53.47,49.91
  Bottom 1.27: 29.02,54.48 D18.3
COMP  (via drill 0.4)
  Top 0.254: v79.63,37.15 79.63,41.85 80.33,42.55 80.33,43.37 79.69,44 v79.57,44
  Bottom 0.254: IC3.3 79.4,43.84 v79.57,44 | v79.63,37.15 79.63,36.51 JP9.1
  Bottom 0.305: R54.2 C47.2 R49.2 80.39,44.83 v79.57,44
CT_OUT+  (via drill 0.4)
  Top 0.305: TR2.3 62.87,70.6 62.87,67.4 R19.1 62.99,66.74 61.66,65.41 61.66,53.98 64.9,50.74 v66.36,50.74
  Bottom 0.305: D20.A 65.98,37.91 65.91,37.97 65.91,49.21 66.17,49.47 66.17,50.55 v66.36,50.74
CT_OUT-  (via drill 0.4)
  Top 0.305: TR2.1 62.85,74.61 62.36,74.61 61.09,73.34 R19.2 | R19.2 61.28,66.74 | R19.2 61.09,53.78 65.09,49.78 v65.34,49.78
  Bottom 0.305: 67.5,37.59 R53.1 | R50.2 68.01,37.08 R53.1 | R53.1 67.56,36.77 67.5,36.83 65.34,36.83 65.02,37.15 65.02,38.61 65.34,38.92 v65.34,49.78
DC_BUS  (via drill 0.4)
  Top 0.305: v67.56,67.69 v66.8,67.69 | 79.34,68.29 79.38,68.33 | 87.88,72.39 87.82,72.39 86.78,73.44
  Top 0.406: v66.8,67.69 66.8,68.14 66.99,68.33 | v68.33,67.69 v67.56,67.69
  Top 0.813: v17.02,82.55 17.02,85.34 19.49,87.82 73.79,87.82 77.66,83.95 77.66,73.79 82.17,69.28 C32.+ 86.67,69.28 88.52,71.12 104.62,71.12 L3.P$1
  Top 2.54: C32.+ 81.67,68.33 79.38,68.33 66.99,68.33 66.36,68.96 TR2.7 | C31.+ 101.41,75.05 108.52,82.17 124.21,82.17 125.62,83.58 B1.+
  Top 3.81: C31.+ 88.39,75.05 86.78,73.44 C32.+
  Bottom 0.305: C33.1 67.63,67.75 v67.56,67.69 | R29.1 82.24,68.9 C32.+
  Bottom 0.61: L3.P$1 JP2.1
  Bottom 0.813: D14.C v17.02,82.55
DC_OUT
  Top 0.61: L2.2 136.31,37.46 C11.1 139.76,37.47 143.05,40.75 X2.8
FB  (via drill 0.4)
  Top 0.254: v78.87,47.43 76.83,47.43 | 76.83,47.43 73.53,47.43 72.52,48.45 70.48,48.45 65.15,53.78 v64.01,53.78 | 77.47,47.44 76.83,47.43 | R57.1 76.84,47.44 76.83,47.43
  Top 0.305: R42.1 v60.01,50.42 | C48.1 76.71,49.15 R57.1
  Bottom 0.254: IC3.2 78.9,44.49 79.25,44.83 79.25,47.05 v78.87,47.43 78.49,47.06 R52.1
  Bottom 0.305: v60.01,50.42 60.64,50.42 v64.01,53.78
FB2
  Bottom 0.305: R17.1 117.16,33.78 117.22,33.85 116.27,33.85 115.57,34.54 | 115.57,34.54 115.25,34.86 | OK1.2 115.57,35.43 | 115.57,35.43 115.57,34.54 | ZD3.C 115.52,35.49 115.57,35.43
GND  (via drill 0.4, 0.5)
  Top 0.254: IC5.7 v59.05,28.3 | v142.69,35.43 142.69,36.39 JP3.NO
  Top 0.305: IC5.6 60.33,25.53 60.01,25.21 v52.01,25.21 | v115.76,19.11 115.06,19.11 | 115.06,19.11 C14.1 | v114.36,19.11 115.06,19.11 | C78.2 78.5,28.3 | v73.78,19.48 73.88,19.58 IC6.5
  Top 0.406: v142.62,30.99 141.79,30.99 C22.2 | v63.05,23.73 63.05,23.05 R70.2 | IC6.3 67.32,21.39 v67.31,21.38 | C74.2 66.18,18.29 v66.16,18.27 | v79.82,27.8 79.82,27.88 79.76,27.94 79.06,27.94 C78.2 | C70.2 77.43,24.08 v76.89,23.54
  Top 0.61: v126.81,17.27 126.81,16.57 C15.1
  Top 0.813: C63.2 50.93,9.4 v50.99,9.46 | C69.2 v49.79,21.33 v49.78,21.34
  Bottom 0.305: v52.01,25.21 52.01,23.11 51.63,22.73 | X2.6 146.81,35.75
  Bottom 0.406: C62.1 v126.43,12.32 | R67.1 v123.06,8.64
  Bottom 0.61: C61.2 137.41,9.09 X4.2 135.4,10.5 C68.1
  Bottom 0.813: v114.36,19.11 101.79,19.11 96.77,24.13 96.77,24.72 TR1.9 | Q7.2 49.91,10.04 v50.99,9.46 | v49.78,21.34 49.28,22.1 Q8.2 | C60.2 C61.2
  Bottom 1.27: C20.- 133.79,21.78 133.1,21.08 105.03,21.08 101.76,24.35 TR1.11 TR1.10 | 115.76,14.73 97.53,14.73 C55.- 96.52,13.78 95.57,14.73 91.82,14.73 89.47,17.08
  Bottom 2.032: X2.2 146.91,25.75 146.75,25.91
  Bottom 3.048: Q8.2 51.63,22.73 52.45,22.73 55.37,19.81 55.37,15.49 56.39,14.48 59.76,14.48 C54.- 57.02,10.35 Q7.2
  other vias: 142.62,31.75 126.05,17.27
  pour Bottom (isolate 0.305): 114.36,39.81 113.79,39.24 113.79,22.67 114.36,22.1 132.84,22.1 133.86,23.11 134.37,23.11 134.37,20.57 133.86,20.57 133.35,20.07 114.81,20.07 114.81,14.22 131.64,14.22 132.65,15.24 147.32,15.24 147.32,39.24 146.75,39.81
  pour Bottom (isolate 0.305): 58.23,16.51 57.66,17.08 57.66,29.15 58.23,29.72 89.6,29.72 90.17,29.15 90.17,16.51
  pour Top: 57.72,10.16 97.54,10.16 101.09,6.6 137.1,6.6 137.67,7.18 137.67,11.49 135.95,13.21 116.97,13.21 115.44,11.68 114.68,11.68 112.65,13.72 101.03,13.72 98.23,16.51 57.72,16.51 57.15,15.94 57.15,10.73
  pour Top (isolate 0.305, no thermals): 134.68,11.87 136.84,11.81 136.91,11.81 137.41,11.3 137.41,9.02 134.68,9.02
GNDA
  Bottom 2.54: B1.- 104.71,87 SH1.P$1
HD
  Bottom 0.305: R22.2 51.5,60.01 52.07,59.44 69.34,59.44 76.77,52.01 76.77,43.05 77.28,42.55 IC3.5
HI_OUT
  Bottom 0.406: IC2.15 48.51,70.74 48.83,71.06 52.58,71.06 54.29,72.77 54.29,75.69 R21.2 | 57.72,78.04 R20.2 57.41,78.11 57.34,78.04 56.2,78.04 54.99,76.84 R21.2 | R21.2
HOLE_DL  (via drill 3.2 pad 5.5)
  other vias: 150,4.5
HOLE_DR  (via drill 3.2 pad 5.5)
  other vias: 5,5
HOLE_UR  (via drill 3.2 pad 5.5)
  other vias: 5,85
L_PULL  (via drill 0.6)
  Top 2.184: 4.82,64.45 L7.1 4.83,54.29 4.95,54.17
  Top 2.54: v7.81,54.17 4.95,54.17
  Bottom 0.305: v6.86,55.12 v7.81,55.12 v8.76,55.12 v8.76,54.17 v8.76,53.21 | v6.86,54.17 v6.86,53.21 v7.81,53.21 8.38,53.21 8.38,53.59
  Bottom 0.406: D18.2 26.48,46.3 26,45.82 | 8.38,53.21 v8.76,53.21
  Bottom 0.813: 23.87,28.2 C38.2 23.18,29.15 19.95,29.15 TR3.P1_DOT
  Bottom 2.54: v7.81,54.17 v8.76,54.17 17.65,54.17 26,45.82 Q6.D 26,40.77 26,40.29 17.99,32.28 TR3.P1_DOT
L_PUSH  (via drill 0.4, 0.5)
  Top 0.406: v48.26,52.2 50,52.2
  Top 0.813: v8.45,27.11 18.65,27.11 TR3.P1
  Top 2.184: L6.1 52.77,55.57
  Top 2.54: 52.77,55.57 50,52.79 50,52.2 Q5.D
  Bottom 0.406: D15.2 47.05,52.2 v48.26,52.2
  Bottom 0.813: 7.36,25.91 R24.2 7.3,27.11 v8.45,27.11
  Bottom 2.54: TR3.P1 27.61,36.07 46.67,36.07 50,39.4 Q5.D
LD
  Bottom 0.305: R23.2 49.4,59.82 50.42,58.8 69.15,58.8 76.2,51.75 76.2,42.8 77.11,41.89 IC3.6
LO_OUT
  Bottom 0.406: IC2.10 42.16,70.8 41.85,71.12 33.47,71.12 | R28.1 33.47,71.12 | 33.47,71.12 31.37,71.12 R31.1
N$1
  Top 0.305: X2.4 150.03,30.75 150.88,29.91 150.88,22.54 149.92,21.59 145.89,21.59 D27.A
N$2
  Bottom 0.305: TP2.1 74.28,65.23 R36.1 74.23,66.89 R29.2
N$3  (via drill 0.4)
  Top 0.406: v50.42,70.04 50.99,70.61 v50.99,72.2 51.37,72.2 v53.53,70.04
  Bottom 0.406: C28.1 C29.1 C30.1 48.09,72.01 v50.99,72.2 | 49.78,69.22 IC2.16 50,69.62 v50.42,70.04 | 54.99,69.47 54.99,67.75 D9.3 53.09,68.52 53.09,69.6 v53.53,70.04
  Bottom 0.61: D9.1 54.99,69.47
N$4
  Top 0.406: JP4.COM 120.08,48.7 C17.1
N$5
  Bottom 0.813: R25.2 R24.1
N$6  (via drill 0.4)
  Top 0.406: v59.05,20.32 IC5.2 | R69.2 65.34,20.45 64.14,19.24 60.52,19.24 v59.82,18.54
  Bottom 0.406: C64.1 59.79,18.52 v59.82,18.54 59.82,19.43 | C65.1 59.82,19.43 | 59.82,19.43 59.82,20.32 v59.05,20.32
N$7
  Top 0.305: 77.79,54.93 77.79,56.52 78.04,56.77 C51.1 78.26,58.13 R56.1 | 77.79,54.93 77.79,54.04 78.74,53.09 R61.1 79.18,52.96 79.18,52.51 79.88,51.82 79.88,50.55 80.33,50.1 IC4.2 | D23.C 77.79,54.93
N$8
  Bottom 0.406: R64.1 C62.2
N$9
  Bottom 0.305: C76.2 R83.2
N$10  (via drill 0.4)
  Top 0.305: R87.1 73.41,25.78 74.04,25.78 v74.17,25.65
  Bottom 0.305: R83.1 C73.2 | C73.2 73.79,26.6 74.93,25.46 77.15,25.46 77.79,24.83 77.79,23.88 78.36,23.3 IC7.2 | v74.17,25.65 74.17,26.36 C73.2
N$11
  Top 0.305: R76.2 143.58,16.32 LED1.TA
N$12
  Bottom 0.305: R77.1 R81.2
N$13
  Bottom 0.61: R44.1 58.23,43.75 58.23,42.1 58.17,42.04 D19.C 56.2,42.04 Q5.G
N$14
  Bottom 0.356: D21.C 34.29,41.21 34.42,41.34 34.42,42.86 R47.1
  Bottom 0.61: D21.C 31.8,41.21 Q6.G
N$15
  Top 2.54: Q2.D 67,76.03 TR2.8
N$16
  Top 0.305: R75.2 144.21,19.56 146.78,19.56 LED1.BA
N$17
  Bottom 0.813: C38.1 21.41,25.4 R25.1
N$18
  Top 0.254: IC5.3 60.32,20.37 60.64,20.05 62.59,20.05 R70.1
N$19
  Bottom 0.254: 69.79,47.82 R46.1 70.04,46.99 70.93,46.1 70.93,44.83 71.27,44.49 IC3.15
N$20  (via drill 0.4)
  Top 0.305: v115.57,55.88 118.62,55.88 v118.68,55.95
  Bottom 0.305: R15.1 111.29,54.17 IC1.8 | R15.1 | R15.1 115.51,54.17 115.57,54.23 v115.57,55.88 | R8.2 v118.68,55.95
N$21
  Bottom 0.508: D10.A 61.84,81.15 Q2.G 61.15,81.32 61.15,79.76 59.88,78.49 R20.1
N$22
  Bottom 0.254: IC3.14 71.22,43.84 70.04,45.02 R45.1
N$23
  Bottom 0.254: IC3.13 70.05,43.19 C43.2
N$24
  Bottom 0.406: Q1.E 97.51,58.1 C6.1 96.31,56.77 92.08,56.77 91.5,57.34 JP1.1
N$25
  Bottom 0.254: 72.2,45.14 IC3.16 71.89,45.14 71.44,45.59 71.44,47.43 70.55,48.32 70.27,48.32 C40.1 | C40.1 70,48.9 71.25,48.9 R39.1 | ZD4.C 69.62,48.97 C40.1
N$26
  Top 0.254: IC4.6 86.24,48.83 84.96,50.1 84.96,54.99 85.03,54.93 R59.1 85.35,54.68
  Top 0.305: 84.96,54.99 84.96,56.33 83.12,58.17 R55.1
N$27  (via drill 0.4)
  Top 0.305: v107.31,55.24 106.68,54.61 101.6,54.61 97.6,58.61 96.84,58.61 | 96.84,58.61 C21.1 | v98.74,56.26 98.74,56.71 96.84,58.61
  Bottom 0.305: C18.2 107.25,55.82 107.25,55.31 v107.31,55.24 107.38,55.18 IC1.5
  Bottom 0.406: ZD2.C 97.47,49.84 D6.C 97.92,49.91 97.92,55.44 v98.74,56.26
N$28
  Bottom 0.305: C71.2 70.61,12.96 R80.2
N$29
  Bottom 0.406: R32.1 35.45,76.95 34.47,76.95 R28.2 33.39,75.94 D13.A 30.92,77.79 30.92,81.07 Q3.G
N$30
  Top 0.305: R42.2 R43.1
N$31
  Bottom 0.406: R18.1 60.83,64.87 D9.2
N$32
  Bottom 0.305: R35.1 88.71,34.61 86.23,34.61 86.17,34.67 86.23,34.67 OK2.2
N$33
  Bottom 0.813: R1.2 R2.1
N$34
  Top 0.305: C53.2 R57.2 78.93,48.83 IC4.3
N$35
  Bottom 0.813: R34.2 R37.2 D14.A
N$36
  Bottom 0.305: IC2.1 49.78,63.63 51.37,62.04 R22.1
N$37
  Bottom 0.254: IC3.12 71.37,42.54 C46.2 R48.2
N$38  (via drill 0.4)
  Top 0.254: 82.3,51.37 83.12,50.55 83.12,49.85 v84.39,48.58
  Top 0.305: IC4.1 82.3,51.37
  Bottom 0.254: 84.96,44.23 84.96,48.01 v84.39,48.58
  Bottom 0.305: 84.96,44.23 D22.A
N$39  (via drill 0.4)
  Top 0.406: 68.14,20.07 68.19,20.12 IC6.4 68.71,20.12 68.77,20.07 68.77,18.31 C74.1 68.8,18.1 69.68,17.21 88.39,17.21 91.76,20.57 v91.76,25.02
  Bottom 0.406: v91.76,25.02 91.76,26.48 JP7.1
N$40
  Bottom 0.305: IC2.2 48.51,62.8 R23.1
N$41
  Bottom 0.813: C5.2 120.21,77.6 122.87,80.26
  Bottom 1.016: L1.3 133.05,78.88 SAR1.2
  Bottom 2.54: L1.3 C2.1 124.27,78.87 123.48,79.66 122.87,80.26 120.54,82.6 B1.AC1
N$42  (via drill 0.4)
  Top 0.305: 86.93,47.56 IC4.5 | IC4.5 86.74,47.56 86.74,46.23 R60.1 | IC4.5 88.33,47.56 88.58,47.82 88.58,50.93 89.03,51.37 v89.03,51.63
  Bottom 0.305: X3.1 86.39,56.68 C52.2 89.03,53.3 v89.03,51.63
N$43
  Bottom 0.406: C4.2 119.24,70.09
  Bottom 1.016: L1.1 SAR2.2
  Bottom 2.54: L1.1 130.81,68.88 C2.2 125.44,63.88 119.24,70.09 115.71,73.61 115.35,73.98 115.33,73.99 B1.AC2
N$44
  Bottom 0.254: JP9.2 79.57,35.62 82.3,35.62 82.55,35.37 OK3.4
N$45
  Bottom 0.406: D10.C R21.1
N$46  (via drill 0.4)  (1 unrouted)
  Top 0.406: IC6.8 74.42,23.93 | 74.42,23.93 74.42,23.94 | 75.92,24.44 C70.1 | v91.06,29.46 82.04,29.46 | 82.04,29.46 76.77,29.46 | 76.77,29.46 74.93,29.46 | 74.93,29.46 v72.35,29.46 | C70.1 75.88,24.45 75.06,25.27 75.06,29.34 74.93,29.46 | R84.2 76.71,29.4 76.77,29.46 | R85.2 82.04,29.46 | 72.33,29.46 64.64,29.46 64.01,28.83 64.01,25.08 65.34,23.75 R69.1 | 74.42,23.93 75.34,23.93 C70.1
  Bottom 0.406: IC7.8 C72.1 72.35,25.34 v72.35,29.46 | JP6.2 v91.06,29.46
N$47  (via drill 0.4)
  Top 0.254: IC4.7 v86.11,50.1
  Bottom 0.254: 86.81,44.32 86.81,49.4 v86.11,50.1
  Bottom 0.305: D24.A 86.81,44.32
N$48
  Bottom 0.406: R27.2 43.5,64.17 IC2.6
N$49
  Bottom 0.305: R7.2 R8.1
N$50  (via drill 0.4)
  Top 0.254: R87.2 71.31,25.97 R88.2
  Top 0.305: v70.48,18.16 70.48,24.26 71.25,25.02 R88.2
  Bottom 0.305: R81.1 R80.1 v70.48,18.16
N$51  (via drill 0.4)
  Top 0.305: R58.1 v88.2,40.2 88.14,41.59 R51.2
  Bottom 0.305: D22.C D24.C 86.83,41.53 | 86.83,41.53 86.83,41.81 | 86.83,41.53 86.87,41.53 v88.2,40.2
N$52
  Bottom 0.406: R31.2 D13.C
N$53  (via drill 0.4)
  Top 0.305: v72.14,19.88 72.14,21.46 73.34,22.66 IC6.7 76.9,22.66 R74.1
  Bottom 0.305: R79.2 71.31,20.7 v72.14,19.88
N$54  (via drill 0.4)  (1 unrouted)
  Top 0.305: v78.11,45.66 80.2,45.66 80.9,44.96 80.9,41.4 v81.09,41.21
  Top 0.406: R40.1 81.22,36.89 81.09,37.02 v81.09,41.21
  Bottom 0.305: IC3.1 78.09,45.64 v78.11,45.66 | 81.09,41.7 v81.09,41.21
  Bottom 0.356: IC3.7 81.06,41.24
  Bottom 0.406: C42.1 81.09,41.7 | C41.1 80.39,40.52 v81.09,41.21
N$55
  Bottom 0.406: C37.1 C36.1 43.5,72.3 | 43.5,72.3 C35.1 44.36,72.26 | D12.C 41.66,66.67 43.43,68.45 IC2.11 43.43,72.24 43.5,72.3
N$56
  Bottom 0.305: R48.1 R50.1 69.91,34.99 68.9,33.97 67.15,33.97 D20.C
N$57  (via drill 0.4)
  Top 0.305: v87.76,24.96 87.06,24.96 85.28,23.18 85.28,20 84.26,18.99 76.39,18.99 75.37,20 v75.37,20.51
  Bottom 0.305: 73.66,20.73 IC7.5 | IC7.5 | JP8.COM v87.76,24.96 87.76,25.66 C79.1 | IC7.5 73.75,20.64 75.25,20.64 v75.37,20.51
N$58
  Bottom 0.305: P1.S 86.55,23.75 JP8.NO
N$59
  Top 0.305: C50.2 R62.1 80.65,54.93 D23.A
N$63
  Bottom 0.406: D12.A 39.37,62.04 R30.1
N$64  (via drill 0.4)
  Top 0.305: R82.2 C75.2 65.34,25.59 66.93,24 66.93,23.18 67.37,22.73 v67.56,22.73 68.42,22.73 IC6.2
  Bottom 0.305: R79.1 R86.1 v67.56,22.73
N$66
  Top 0.813: R65.2 R66.2 44.64,10.09 44.64,9.34 44.7,9.4 C63.1
N$67
  Top 0.813: R72.2 R73.2 44.64,20.95 44.64,20.32 44.77,20.19 C69.1
N$74
  Top 0.508: IC5.1 57.78,21.14 57.66,21.02 R68.2 53.22,21.01 D25.C
N$75
  Top 0.508: R71.2 55.62,28.36 D26.C 57.34,28.07 57.78,27.62 IC5.8
N$76
  Bottom 0.305: 81.25,28.7 OK3.2 79.22,28.67 78.93,28.38 78.93,27.75 77.98,26.8 C76.1 | C73.1 77.78,26.73 C76.1 | 79.06,24.6 IC7.1 | IC7.1 78.93,24.67 78.93,25.59 C76.1 | IC7.1
N$100
  Top 0.305: Q4.2 86.11,39.24 86.04,39.31 86.04,41.15 R51.1 86.02,41.12 C44.1
N$126  (via drill 0.4)
  Top 0.254: 84.05,38.54 83.76,38.54 | 83.76,38.54 v83.25,38.54 | D16.C 83.95,35.37 83.69,35.62 83.69,38.48 83.76,38.54
  Top 0.305: 84.05,38.54 Q4.3
  Bottom 0.254: D17.C 77.75,38.77 77.85,38.86 82.93,38.86 v83.25,38.54
N$130  (via drill 0.4)
  Top 0.305: D16.A 88.01,35.37 88.58,35.94 v88.58,37.78
  Bottom 0.305: v88.58,37.78 88.58,37.02 R35.2
N$132
  Top 0.305: IC6.6 75.89,21.39 76.9,20.39 R74.2 R78.1
N$133
  Bottom 0.305: R4.2 C8.1 97.59,63.82 ZD1.C 95.78,62.01 Q1.B
N$134
  Top 0.305: 68.64,25.97 R89.2 69.25,25.94 | 68.64,25.97 67.31,25.97 C75.1 | IC6.1 68.48,25.81 68.64,25.97
N$135
  Bottom 0.305: OK1.1 116.84,35.5 R13.2
N$137
  Top 1.016: D3.C 107.96,49.4 C12.2 110.28,49.42 R6.2
N$138
  Bottom 0.305: IC1.7 109.92,53.28 110.3,52.9 112.46,52.9 C23.2 C25.1 113.16,49.78 113.41,49.78 116.84,46.35 OK1.4
N$139
  Top 0.61: C9.1 R5.2
N$140
  Top 0.61: C3.1 R3.2
N$141  (via drill 0.4)
  Top 0.305: R11.1 109.73,56.33 v109.79,56.26
  Bottom 0.305: IC1.6 108.65,56.14 C24.1 v109.79,56.26 R14.2 R12.1
N$144
  Top 0.61: R9.2 C16.1
N$146
  Top 0.61: C19.1 R10.2
N$152
  Bottom 0.305: C23.1 117.03,52.2 R16.1
N$155  (via drill 0.4)
  Top 0.305: D8.C 106.39,59.56 | 106.39,59.56 D7.C | v110.3,59.44 106.52,59.44 106.39,59.56
  Bottom 0.305: 112.33,58.61 112.33,59.05 111.95,59.44 v110.3,59.44
  Bottom 0.406: R12.2 112.71,58.23 112.33,58.61
NFB_OFFSET  (via drill 0.4)
  Top 0.305: R82.1 R89.1 v70.29,27.88 v70.29,27.87 R88.1
  Top 0.406: R88.1
  Bottom 0.305: C77.+ 68.33,27.88 v70.29,27.88
OK_A  (via drill 0.4)
  Top 0.305: R85.1 82.36,26.23 v83.12,26.23
  Bottom 0.305: 82.55,27.94 82.55,26.8 v83.12,26.23
  Bottom 0.406: 82.61,28 82.55,27.94 OK3.1
PE  (via drill 3.2 pad 5.5)
  Top 0.61: JP4.NC 128.84,50.23 C4A.1
  Top 0.813: C5A.1 124.46,59.69 110.55,73.6 C4.1 C5.1
  Top 1.27: v150,85 149.84,84.84 141.16,84.84 137.86,81.53 137.86,68.96 C5A.1 C4A.1 130.27,48.8 X1.3
  Bottom 0.508: X1.3 144.3,48.8 152.02,41.08 152.02,15.11 150.43,13.53 147.76,13.53 146.3,12.06 146.3,5.59 | C68.2 133.35,4.25 134.75,2.86 144.65,2.86 146.3,4.51 | C66.2 58.54,1.4 144.72,1.4 146.3,2.98 146.3,4.51 | 146.3,4.51 146.3,5.59 | C67.2 146.3,5.58 146.3,5.59
POUT+  (via drill 0.4, 0.5)
  Top 0.305: L8.1 110.24,3.75
  Top 0.406: C54.+ 57.21,6.28 57.09,6.16
  Top 3.048: SH2.P$2 60.33,2.6 | SH3.P$1 57.09,6.16
  Bottom 0.254: 111.25,3.88 111.25,4.7 v111.44,4.89
  Bottom 0.305: 111.25,3.88 R63.1
  Bottom 0.406: C66.1 v57.47,4.38
  pour Top (no thermals): 108.58,1.78 108.58,5.84 110.43,5.84 111,5.27 111,1.78
  pour Top (isolate 0.406): 110.43,1.21 57.15,1.21 57.15,8.83 57.72,9.4 97.22,9.4 100.77,5.84 110.43,5.84 111,5.27 111,1.78
PREG_OUT+  (via drill 0.5)
  Top 0.305: 114.62,2.79 114.62,2.67
  Top 0.406: 114.62,2.79 114.62,3.96 L8.2 | JP3.NC 145.8,36.45 146.37,37.02 149.73,37.02 152.02,34.73 152.02,15.11 150.43,13.53 147.57,13.53 145.41,11.37
  Top 0.508: X4.1 140.88,10.5 140.08,11.3 140.08,12.76 139.19,13.65 TP6.TIP
  Top 0.61: v113.41,4.89 113.98,4.89
  Bottom 0.254: R63.2 | C71.1 72.93,8.87 R77.2 115.44,9.15 119.06,5.52 v120.9,5.52
  Bottom 0.305: 113.47,3.81 R63.2
  Bottom 0.406: R64.2 v126.05,4.51 | R67.2 v123.06,4.7 | v113.41,4.89 113.41,4 R63.2
  Bottom 0.61: C61.1 140.21,9.21 X4.1 141.9,10.5 C67.1
  Bottom 0.813: C60.1 C61.1
  other vias: 126.87,4.51
  pour Top (no thermals): 113.79,1.78 113.79,5.27 114.36,5.84 115.89,5.84 115.82,1.21 114.36,1.21
  pour Top: 113.79,5.27 114.36,5.84 134.56,5.84 135.06,5.33 139.19,5.33 139.95,6.1 139.95,11.94 145.29,11.94 146.05,11.18 146.05,1.78 145.48,1.21 114.36,1.21 113.79,1.78
  pour Top (isolate 0.305, no thermals): 139.95,11.94 143,11.94 143,8.51 139.95,8.51
PULL  (via drill 0.4)
  Top 0.356: v72.39,37.53 38.48,37.53 36.77,39.24 v36.77,40.2
  Bottom 0.356: IC3.9 72.39,40.58 v72.39,37.53 | v36.77,40.2 36.77,41.03 D21.A 36.7,41.46 R47.2
  Bottom 0.406: R47.2 36.7,43.69
PUSH  (via drill 0.4)
  Top 0.356: v76.52,40.2 v63.69,40.2
  Bottom 0.356: IC3.8 76.91,40.59 v76.52,40.2 | v63.69,40.2 61.85,42.04 D19.A 59.94,42.85 R44.2
REF
  Bottom 0.406: IC2.8 40.89,65.34 41.34,65.79 46.86,65.79 47.24,65.41 IC2.3 47.24,62.19 | 47.24,62.19 C34.2 | 47.24,62.19 47.35,62.19 47.35,60.28 R38.2
S1_DOT_OUT  (via drill 0.6)
  Top 0.305: 51.44,17.91 51.75,18.22 51.75,22.1 52.9,23.24 61.4,23.24 61.59,23.05 IC5.4
  Bottom 3.048: 32.51,7.11 24.38,7.11 22.07,4.8 TR3.S1_DOT
  other vias: 34.1,17.72 35.24,17.72 36.39,17.72 37.53,17.72 38.67,17.72 39.81,17.72 40.96,17.72 42.1,17.72 43.24,17.72 44.39,17.72 32.96,17.72 34.1,16.64 34.1,15.56 34.1,14.48 34.1,12.32 34.1,13.4 32.96,16.64 32.96,15.56 32.96,14.48 32.96,13.4 32.96,12.32 34.1,11.24 34.1,10.16 34.1,9.08 32.96,11.24 32.96,10.16 32.96,9.08
  pour Bottom (isolate 0.406, no thermals): 49.02,5.27 48.45,4.7 30.8,4.7 30.23,5.27 30.23,17.59 30.8,18.16 48.45,18.16 49.02,17.59
  pour Top (isolate 0.406, no thermals): 51.69,8.76 51.12,8.19 29.27,8.19 28.7,8.76 28.7,17.59 29.27,18.16 51.69,18.16
S1_OUT
  Top 3.048: SH2.P$1 26.25,2.6 TR3.S1
S2_DOT_OUT
  Top 3.048: TR3.S2_DOT 15.07,5.23 16.7,6.86 27.43,6.86 28.13,6.16 SH3.P$2
S2_OUT  (via drill 0.6)
  Top 0.305: IC5.5 61.59,25.46 60.39,24.26 50.35,24.26
  Bottom 3.048: TR3.S2 18.57,9.62 29.59,20.64 34.16,20.64
  other vias: 34.1,29.27 34.1,28.19 34.1,27.11 34.1,26.04 34.1,24.96 34.1,23.88 34.1,22.8 35.24,30.35 36.39,30.35 37.53,30.35 38.67,30.35 39.81,30.35 40.96,30.35 42.1,30.35 43.24,30.35 44.39,30.35 32.96,22.8 32.96,23.88 32.96,24.96 32.96,26.04 32.96,27.11 32.96,28.19 32.96,29.27 34.1,30.35 32.96,30.35
  pour Top (isolate 0.406, no thermals): 50.8,19.75 50.23,19.18 30.54,19.18 29.97,19.75 29.97,30.99 30.54,31.56 50.23,31.56 50.8,30.99
  pour Bottom (isolate 0.406, no thermals): 48.45,19.18 29.97,19.18 29.97,30.99 30.54,31.56 48.45,31.56 49.02,30.99 49.09,19.81
SR_OUT1  (via drill 0.4)
  Top 0.508: R68.1 53.86,19.11 D25.A 52.9,18.15 v52.9,16.32
  Bottom 0.508: Q7.1 52.01,15.43 v52.9,16.32
SR_OUT2  (via drill 0.4)
  Top 0.406: 53.34,30.4 R71.1
  Top 0.508: v53.02,27.11 52.97,27.17 D26.A 53.4,28.55 53.4,29.91 53.51,30.02 R71.1
  Bottom 0.508: Q8.1 52.32,27.81 v53.02,27.11
U_MON  (via drill 0.4)
  Top 0.305: v128.02,29.4 132.46,33.85 148.2,33.85 X2.5 | v94.87,29.4 92.46,29.4 v91.12,28.07
  Bottom 0.305: v128.02,29.4 v94.87,29.4 | JP8.NC 90.87,25.84 90.87,27.81 v91.12,28.07
U_MON1
  Bottom 0.305: IC7.6 IC7.7 71.87,23.3 R86.2
ULVO  (via drill 0.4)
  Top 0.305: v70.48,55.12 70.48,61.52 TP2.2
  Bottom 0.254: R41.1 74.74,51.24 75.06,50.93 75.06,38.32 D17.A
  Bottom 0.305: R41.1 R39.2 71.57,51.24 71.31,51.5 71.31,54.1 70.48,54.93 v70.48,55.12 | R36.2 72.33,63.36 TP2.2
V+  (via drill 0.4)
  Top 0.305: v125.79,33.21 v125.79,27.88 | R76.1 R75.1 141.04,19.05 v142.18,20.19 | v142.81,26.73 142.81,28.96 142.94,29.08
  Top 0.406: v130.3,28.77 130.37,28.77 130.68,29.08 142.94,29.08 144.27,29.08
  Top 1.27: L5.2 144.27,29.08 C22.1 145.86,31.3 146.62,30.54 146.62,29.34 147.71,28.25 X2.3
  Bottom 0.305: R17.2 v125.79,33.21 | v142.18,20.19 142.18,26.1 v142.81,26.73
  Bottom 0.406: v130.3,28.77 129.35,27.81 125.86,27.81 v125.79,27.88 125.54,28.07 94.3,28.07 92.9,29.46 JP6.1
V-  (via drill 0.4)
  Top 0.406: C15.2 v126.43,25.15
  Top 0.61: L4.2 124.82,18.99 C15.2 134.69,18.99 139.13,23.43 148.62,23.43 X2.1
  Bottom 0.406: v126.43,25.15 125.6,25.15 123.38,27.37 94.3,27.37 93.6,26.67 JP7.2
VIPER+
  Top 0.813: L3.P$2 113.07,66.06 116.39,62.74 C13.+
  Top 1.016: C13.+ 113.12,58.51 R6.1 113.12,49.42 C12.1 113.1,46.8 111.06,44.77 110.54,44.77 TR1.1 TR1.2
  Bottom 0.305: R7.1 117.37,62.76 C13.+
  Bottom 0.61: L3.P$2 JP2.2
VIPER_D
  Top 1.016: D3.A 103.01,49.13 TR1.4
  pour Bottom (isolate 0.305, no thermals): 101.98,50.23 106.36,50.23 106.36,48.01 105.79,47.43 104.27,47.43 104.27,44.58 103.7,44.01 102.55,44.01 101.98,44.58

## Text on the board
tPlace: CAUTION! / HIGH VOLTAGE | LO-SIDE | HI-SIDE | AC in | PULL | EEZ CF-DIC / (12/2018 r5B5) | PUSH | DC out
bPlace: LO-SIDE | HI-SIDE | CAUTION! / HIGH VOLTAGE | AC in | PULL | PUSH | X2 connector | 8 Bias+ | 7 Bias- | 6 U_MON- | 5 U_MON+ (max. 2.5V) | Project source code: github.com/eez-open/CF-DIC | EEZ CF-DIC (12/2018 r5B5) | 4 !FAULT! | SREC2 | 3 V+ | 2 Gnd | 1 V- | SREC1 | DC out
Measures: Licensed under the TAPR Open Hardware License (www.tapr.org/OHL)